# Altium schematic sheet 42Motor_Control.SchDoc
size A3
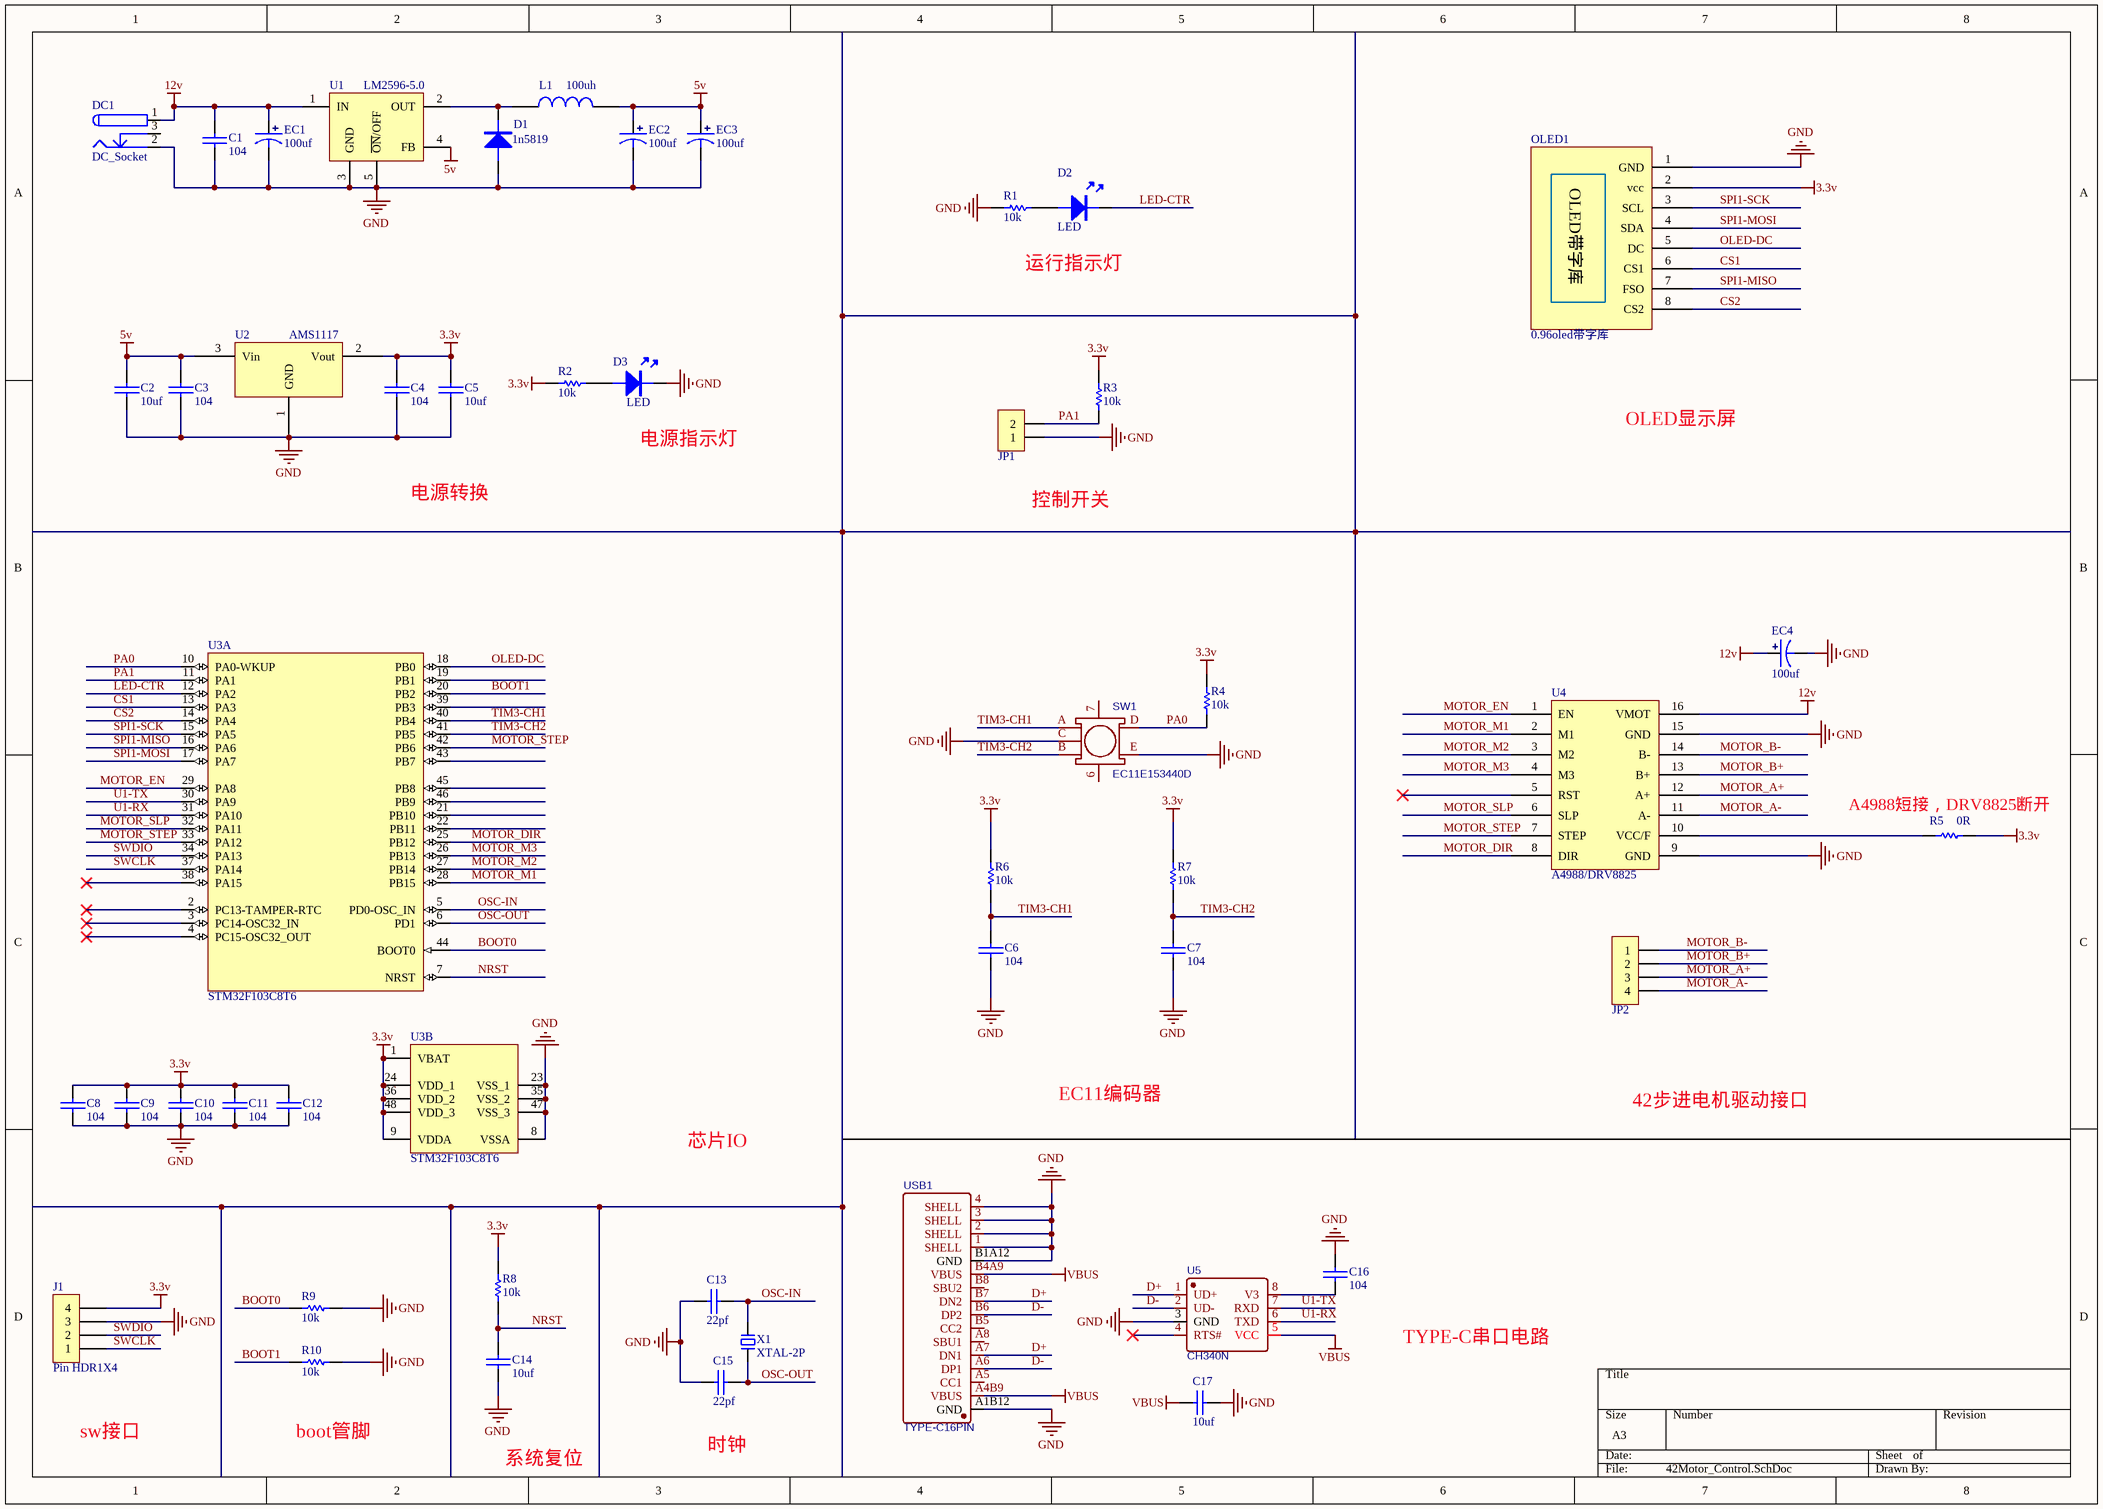
[diagram p0: 42Motor_Control.SchDoc]

## Parts
C1  104  [0603C]
C2  10uf  [0603C]
C3  104  [0603C]
C4  104  [0603C]
C5  10uf  [0603C]
C6  104  [0603C]
C7  104  [0603C]
C8  104  [0603C]
C9  104  [0603C]
C10  104  [0603C]
C11  104  [0603C]
C12  104  [0603C]
C13  22pf  [0603C]
C14  10uf  [0603C]
C15  22pf  [0603C]
C16  104  [0603C]
C17  10uf  [0603C]
D1  1n5819  [SOD-323]
D2  LED  [LED-0603W]
D3  LED  [LED-0603W]
DC1  DC_Socket  [DC-050]
EC1  100uf  [SMD-EC6.3X6.3X10]
EC2  100uf  [SMD-EC6.3X6.3X10]
EC3  100uf  [SMD-EC6.3X6.3X10]
EC4  100uf  [SMD-EC6.3X6.3X10]
J1  Pin HDR1X4  [Pin HDR1X4/2.54mm-S]
JP1  HDR-1X2  [XH2.54-LI-2P]  (value not drawn)
JP2  HDR-1X4  [XH2.54-WI-4P]  (value not drawn)
L1  100uh  [CDRH74]
OLED1  0.96oled带字库  [中景园0.96带字库]
R1  10k  [0603R]
R2  10k  [0603R]
R3  10k  [0603R]
R4  10k  [0603R]
R5  0R  [0603R]
R6  10k  [0603R]
R7  10k  [0603R]
R8  10k  [0603R]
R9  10k  [0603R]
R10  10k  [0603R]
SW1  EC11E153440D  [SW-TH_EC11XXXXXXXX]
U1  LM2596-5.0  [TO263-5A]
U2  AMS1117  [SOT223]
U3  STM32F103C8T6  [LQFP48_N]  (parts A,B of 2)
U4  A4988/DRV8825  [A4988/DRV8825]
U5  CH340N  [SOP-8_L4.9-W3.9-P1.27-LS6.0-BL]
USB1  TYPE-C16PIN  [USB-C-SMD_TYPE-C16PIN]
X1  XTAL-2P  [OSC HC-49SMD]

## Nets
3.3v: C4.2 C5.2 C8.2 C9.2 C10.2 C11.2 C12.2 J1.4 OLED1.2(vcc) R2.2 R3.1 R4.1 R5.1 R6.1 R7.1 R8.2 U2.2(Vout) U3.1(VBAT) U3.9(VDDA) U3.24(VDD_1) U3.36(VDD_2) U3.48(VDD_3)
5v: C2.2 C3.2 EC2.1 EC3.1 L1.2 U1.4(FB) U2.3(Vin)
12v: C1.2 DC1.1 EC1.1 EC4.1 U1.1(IN) U4.16(VMOT)
GND: C1.1 C2.1 C3.1 C4.1 C5.1 C6.2 C7.2 C8.1 C9.1 C10.1 C11.1 C12.1 C13.1 C14.1 C15.1 C16.2 C17.2 D1.A D3.K DC1.2 EC1.2 EC2.2 EC3.2 EC4.2 J1.3 JP1.1 OLED1.1(GND) R1.2 R9.2 R10.2 SW1.C SW1.E U1.3(GND) U1.5(~{ON}/OFF) U2.1(GND) U3.8(VSSA) U3.23(VSS_1) U3.35(VSS_2) U3.47(VSS_3) U4.9(GND) U4.15(GND) U5.3(GND) USB1.1(SHELL) USB1.2(SHELL) USB1.3(SHELL) USB1.4(SHELL) USB1.A1B12(GND) USB1.B1A12(GND)
VBUS: C17.1 U5.5(VCC) USB1.A4B9(VBUS) USB1.B4A9(VBUS)
BOOT0: R9.1 U3.44(BOOT0)
BOOT1: R10.1 U3.20(PB2)
CS1: OLED1.6(CS1) U3.13(PA3)
CS2: OLED1.8(CS2) U3.14(PA4)
D+: U5.1(UD+) USB1.A7(DN1) USB1.B7(DN2)
D-: U5.2(UD-) USB1.A6(DP1) USB1.B6(DP2)
LED-CTR: D2.K U3.12(PA2)
MOTOR_A+: JP2.3 U4.12(A+)
MOTOR_A-: JP2.4 U4.11(A-)
MOTOR_B+: JP2.2 U4.13(B+)
MOTOR_B-: JP2.1 U4.14(B-)
MOTOR_DIR: U3.25(PB12) U4.8(DIR)
MOTOR_EN: U3.29(PA8) U4.1(EN)
MOTOR_M1: U3.28(PB15) U4.2(M1)
MOTOR_M2: U3.27(PB14) U4.3(M2)
MOTOR_M3: U3.26(PB13) U4.4(M3)
MOTOR_SLP: U3.32(PA11) U4.6(SLP)
MOTOR_STEP: U3.33(PA12) U3.42(PB6) U4.7(STEP)
NRST: C14.2 R8.1 U3.7(NRST)
OLED-DC: OLED1.5(DC) U3.18(PB0)
OSC-IN: C13.2 U3.5(PD0-OSC_IN) X1.1
OSC-OUT: C15.2 U3.6(PD1) X1.2
PA0: R4.2 SW1.D U3.10(PA0-WKUP)
PA1: JP1.2 R3.2 U3.11(PA1)
SPI1-MISO: OLED1.7(FSO) U3.16(PA6)
SPI1-MOSI: OLED1.4(SDA) U3.17(PA7)
SPI1-SCK: OLED1.3(SCL) U3.15(PA5)
SWCLK: J1.1 U3.37(PA14)
SWDIO: J1.2 U3.34(PA13)
TIM3-CH1: C6.1 R6.2 SW1.A U3.40(PB4)
TIM3-CH2: C7.1 R7.2 SW1.B U3.41(PB5)
U1-RX: U3.31(PA10) U5.6(TXD)
U1-TX: U3.30(PA9) U5.7(RXD)
NetC16_1: C16.1 U5.8(V3)
NetD1_K: D1.K L1.1 U1.2(OUT)
NetD2_A: D2.A R1.1
NetD3_A: D3.A R2.1
NetR5_2: R5.2 U4.10(VCC/F)

Not connected (* = marked no-connect by the designer): DC1 3; SW1 6 7; U3 2(PC13-TAMPER-RTC)* 3(PC14-OSC32_IN)* 4(PC15-OSC32_OUT)* 19(PB1) 21(PB10) 22(PB11) 38(PA15)* 39(PB3) 43(PB7) 45(PB8) 46(PB9); U4 5(RST)*; U5 4(RTS#)*; USB1 A5(CC1) A8(SBU1) B5(CC2) B8(SBU2)

## Notes on the sheet
- 运行指示灯
- 电源指示灯
- OLED显示屏
- 电源转换
- (near JP1) 控制开关
- (near R5) A4988短接，DRV8825断开
- EC11编码器
- 42步进电机驱动接口
- 芯片IO
- TYPE-C串口电路
- sw接口
- boot管脚
- (near C15) 时钟
- 系统复位
- (in symbol 0.96oled带字库) OLED带字库

## Library data of the parts
C1-C17 = CAP: 无极性电容
D1 = DIODE: 普通二极管
EC1-EC4 = SMD_ECAP: 贴片电解电容
JP1 = Header 2: 2P接插件; 版权归属: 封装库来自淘宝 ID：黄晶宝石; BOM名称: 2P接插件; 联系售后: https://shop463601444.taobao.com
JP2 = Header 4: 4P接插件; 版权归属: 封装库来自淘宝 ID：黄晶宝石; BOM名称: 4P接插件; 学习资源: https://shop463601444.taobao.com
L1 = INDUCTOR
R1-R10 = RES
SW1 = EC11E153440D: BOM_Manufacturer: ALPS Electric; Contributor: LCSC; BOM_Supplier: LCSC; BOM_Supplier Part: C370992; BOM_Manufacturer Part: EC11E153440D; spicePre: S; spiceSymbolName: EC11E153440D
U1 = LM2596-5.0: DC降压芯片
U2 = AMS1117: 三端稳压芯片
U3 = STM32F103C8T6: STM32 ARM-based 32-bit MCU Performance Line with 64 kB Flash, 20 kB Internal RAM, -40 to +85癈 Temperature, 48-Pin LQFP, Tray; DatasheetVersion: rev13.0, Apr-2011; PackageVersion: rev13, Apr-2011; PackageReference: LQFP48; PackageDescription: 48-Pin Low-Profile Quad Flat Pack, 7 x 7 mm Body, 0.5 mm Pitch (LQFP48); ComponentLink1Description: Manufacturer URL; ComponentLink1URL: http://www.st.com/; ComponentLink2Description: STM32F103 Datasheet; ComponentLink2URL: http://www.st.com/internet/com/TECHNICAL_RESOURCES/TECHNICAL_LITERATURE/DATASHEET/CD00161566.pdf; ComponentLink3Description: STM32 Family Web Page; ComponentLink3URL: www.st.com/stm32; 联系售后: https://shop463601444.taobao.com
U5 = CH340N: BOM_Manufacturer: WCH; BOM_Manufacturer Part: CH330N; BOM_Supplier: LCSC; BOM_Supplier Part: C108996; spicePre: U; spiceSymbolName: CH330N
USB1 = TYPE-C16PIN: BOM_Manufacturer: SHOU HAN; Contributor: LCSC; BOM_Supplier: LCSC; BOM_Supplier Part: C393939; BOM_Manufacturer Part: TYPE-C16PIN; spicePre: U; spiceSymbolName: TYPE-C16PIN
X1 = XTAL-2P: 2脚无源脚晶振